# Altium project BrushedMotorBoard.PrjPcb
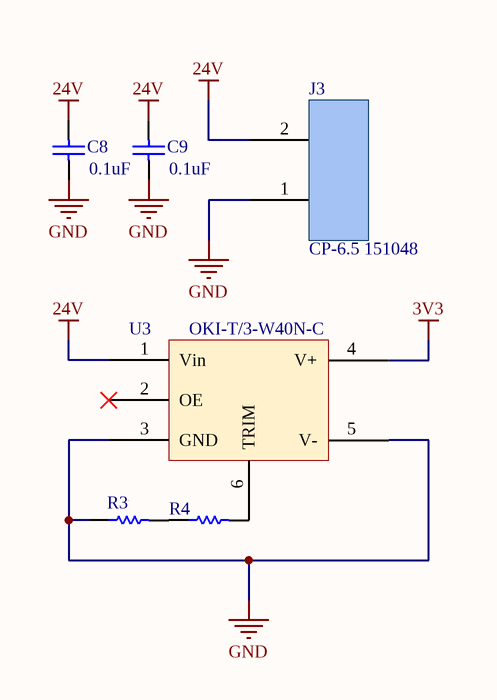
[diagram p0: Power.SchDoc]
3 sheets, 24 parts. Net scope: flat (ports and power ports of the same name join across sheets).
Sheets:
  Power.SchDoc
  Microcontroller.SchDoc
  Peripherals.SchDoc

## Sheet Power.SchDoc
size A

### Parts
C8  value 0.1uF  [CAPC3216X100X50LL20T25]  (hidden comment: C1206F104K3RACTU)
C9  value 0.1uF  [CAPC3216X100X50LL20T25]  (hidden comment: C1206F104K3RACTU)
J3  CP-6.5 151048
R3  RES SMD 6.2K OHM 5% 1/4W 1206  [RESC1206(3216)_L]  (value not drawn)
R4  RES SMD 6.2K OHM 5% 1/4W 1206  [RESC1206(3216)_L]  (value not drawn)
U3  OKI-T/3-W40N-C

### Nets
3V3: U3.4(V+)
24V: C8.1 C9.1 J3.2 U3.1(Vin)
GND: C8.2 C9.2 J3.1 R3.1 U3.3(GND) U3.5(V-)
NetR3_2: R3.2 R4.1
NetR4_2: R4.2 U3.6(TRIM)

Not connected (* = marked no-connect by the designer): U3 2(OE)*

### Library data of the parts
C8 C9 = CMP-1664-00001-1: CAP CER 0.1UF 25V 10% X7R 1206; PackageReference: 1206; PartNumber: C1206F104K3RACTU; ComponentLink1URL: http://www.kemet.com/docfinder?Partnumber=C1206F104K3RACTU; ComponentLink1Description: Datasheet
J3 = CP-6.5 151048: Connector Header Through Hole 2 position
R3 = CMP-1014-00659-1: Tolerance: 0.5%; Power: 0.25 W; Value: 6200; Case-EIA: 1206; Case-Metric: 3216; Technology: SMT
R4 = CMP-1014-00659-1: RES SMD 1.54K OHM 0.1% 1/4W 1206; Tolerance: 0.5%; Power: 0.25 W; Value: 6200; Case-EIA: 1206; Case-Metric: 3216; Technology: SMT

## Sheet Microcontroller.SchDoc
size A
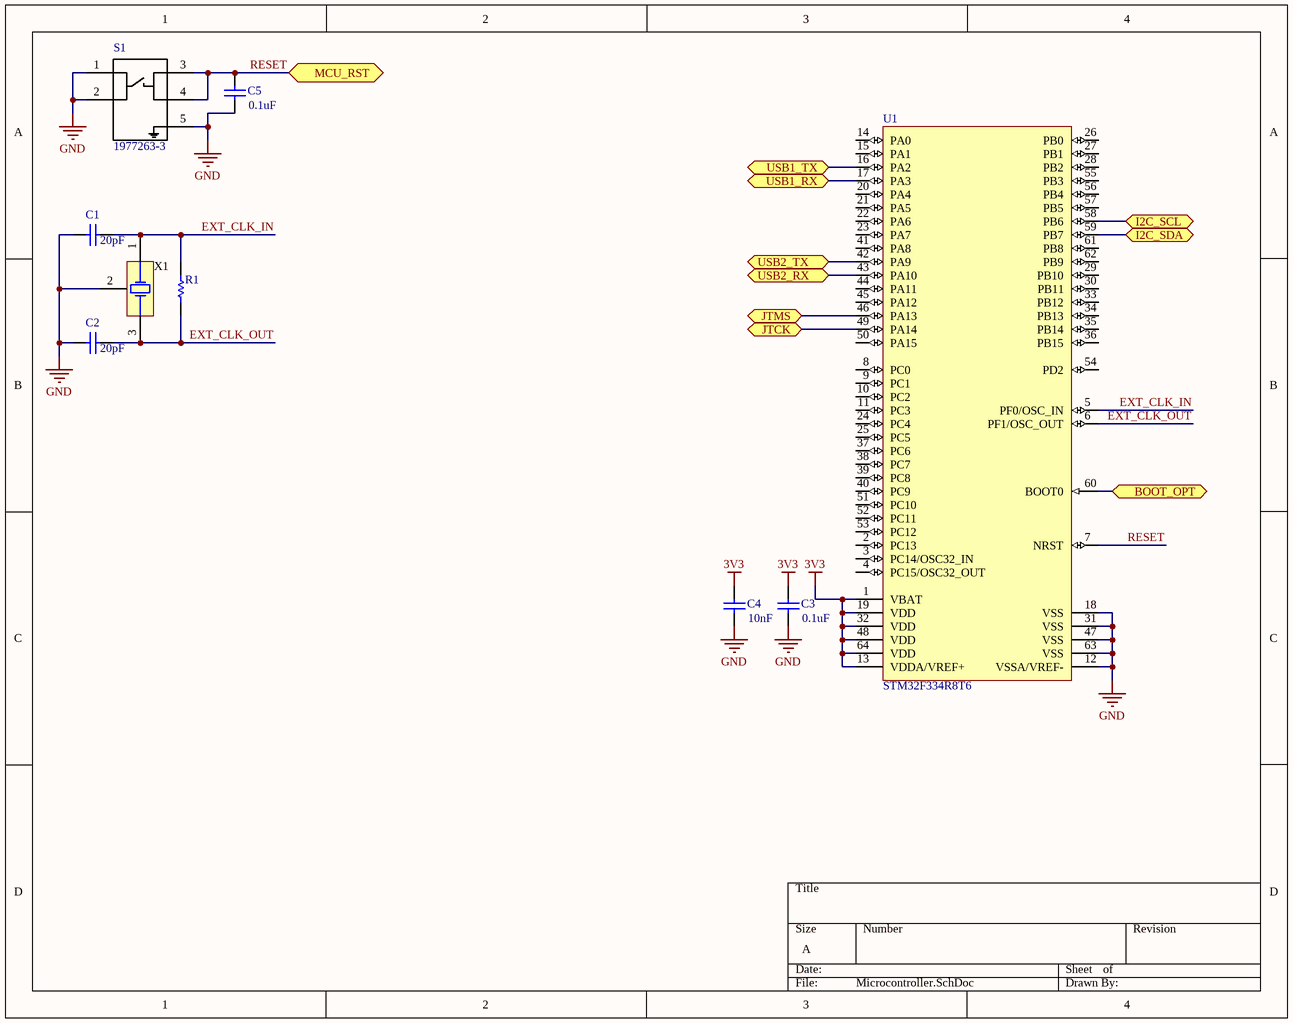
[diagram p1: Microcontroller.SchDoc]

### Parts
C1  value 20pF  [CAPC1206(3216)100_M]  (hidden comment: CAP 20pF 100V 1206(3216))
C2  value 20pF  [CAPC1206(3216)100_M]  (hidden comment: CAP 20pF 100V 1206(3216))
C3  value 0.1uF  [CAPC3216X100X50LL20T25]  (hidden comment: C1206F104K3RACTU)
C4  Capacitance: 10nF  [CAPC3216X88X50LL20T25]  (hidden comment: C1206C103K1RAC)
C5  value 0.1uF  [CAPC3216X100X50LL20T25]  (hidden comment: C1206F104K3RACTU)
R1  1M8 5% 1206(3216)  [RESC1206(3216)_M]  (value not drawn)
S1  1977263-3  [SW_1977263-3]
U1  STM32F334R8T6  [STM-LQFP64_L]
X1  ECS-200-20-4X-3IL  [ECS-4X-3IL]  (value not drawn)

### Ports
BOOT_OPT (bidir), I2C_SCL (bidir), I2C_SDA (bidir), JTCK (bidir), JTMS (bidir), MCU_RST (bidir), USB1_RX (bidir), USB1_TX (bidir), USB2_RX (bidir), USB2_TX (bidir)

### Nets
3V3: C3.1 C4.2 U1.1(VBAT) U1.13(VDDA/VREF+) U1.19(VDD) U1.32(VDD) U1.48(VDD) U1.64(VDD)
GND: C1.1 C2.1 C3.2 C4.1 C5.2 S1.1 S1.2 S1.5(GND) U1.12(VSSA/VREF-) U1.18(VSS) U1.31(VSS) U1.47(VSS) U1.63(VSS) X1.2
EXT_CLK_IN: C1.2 R1.2 U1.5(PF0/OSC_IN) X1.1
EXT_CLK_OUT: C2.2 R1.1 U1.6(PF1/OSC_OUT) X1.3
RESET: C5.1 S1.3 S1.4 U1.7(NRST) ; port MCU_RST
NetJ2_2: U1.43(PA10) ; port USB2_RX
NetJ2_3: U1.42(PA9) ; port USB2_TX
NetP1_2: U1.59(PB7) ; port I2C_SDA
NetP1_3: U1.58(PB6) ; port I2C_SCL
NetP1_4: U1.46(PA13) ; port JTMS
NetP1_5: U1.49(PA14) ; port JTCK
NetP3_2: U1.60(BOOT0) ; port BOOT_OPT
NetU1_16: U1.16(PA2) ; port USB1_TX
NetU1_17: U1.17(PA3) ; port USB1_RX

Not connected (* = marked no-connect by the designer): U1 2(PC13) 3(PC14/OSC32_IN) 4(PC15/OSC32_OUT) 8(PC0) 9(PC1) 10(PC2) 11(PC3) 14(PA0) 15(PA1) 20(PA4) 21(PA5) 22(PA6) 23(PA7) 24(PC4) 25(PC5) 26(PB0) 27(PB1) 28(PB2) 29(PB10) 30(PB11) 33(PB12) 34(PB13) 35(PB14) 36(PB15) 37(PC6) 38(PC7) 39(PC8) 40(PC9) 41(PA8) 44(PA11) 45(PA12) 50(PA15) 51(PC10) 52(PC11) 53(PC12) 54(PD2) 55(PB3) 56(PB4) 57(PB5) 61(PB8) 62(PB9)

### Library data of the parts
C1 C2 = CMP-1037-00946-1: CAP 20pF 100V ±10% 1206 (3216 Metric) Thickness 1mm SMD; Case-Metric: 3216; Case-EIA: 1206; Tolerance: Â±10%; Rated Voltage: 100 V; Max Thickness: 1 mm; Technology: SMT
C3 C5 = CMP-1664-00001-1: CAP CER 0.1UF 25V 10% X7R 1206; PackageReference: 1206; PartNumber: C1206F104K3RACTU; ComponentLink1URL: http://www.kemet.com/docfinder?Partnumber=C1206F104K3RACTU; ComponentLink1Description: Datasheet
C4 = CMP-2000-06007-1: Chip Capacitor, 0.01 uF, +/- 10%, 100 V, -55 to 125 degC, 1206 (3216 Metric), RoHS, Tape and Reel; Manufacturer: Kemet; Ceramic Capacitor Case: 1206[3216Metric]; No. of Pins: 2; SVHC: NoSVHC(16-Dec-2013); Product Range: KEMET-CSeries; Voltage Rating: 100V; Dielectric Characteristic: X7R; Capacitor Terminals: SMD; Operating Temperature Min: -55°C; Datasheet Version: 10/2016; Operating Temperature Range: -55°Cto+125°C; Operating Temperature Max: 125°C; Packaging: CutTape; RoHS Compliant: Yes; MSL: MSL1-Unlimited; Capacitance Tolerance: ±10%; Mounting Technology: SurfaceMount; Package Reference: 1206; Capacitor Case Style: 1206[3216Metric]; Datasheet URL: http://capacitoredge.kemet.com/capedge2/DataSheet/Datasheet-C1206C103K1RAC.pdf?pn=C1206C103K1RAC{BULK}; Package Description: 2-Pin Surface Mount Device, Body 3.2 x 1.6 mm; Manufacturer URL: http://www.kemet.com/
R1 = CMP-1014-00152-1: 1M8 0.25W 5% 1206 (3216 Metric)  SMD; Case-EIA: 1206; Value: 1800000.00 Ohm; Case-Metric: 3216; Tolerance: 5 %; Technology: SMT; Power: 0.25 W
S1 = 1977263-3: Switch Tactile OFF _ON_ SPST Round Button Gull Wing 0.05A 24VDC 1000000Cycle 2.55N SMD Bulk; MF: TE Connectivity / AMP; Price: 0.20 USD; Package: None; MP: 1977263-3; SnapEDA_Link: https://www.snapeda.com/parts/1977263-3/TE%20Connectivity%20/%20AMP/view-part/?ref=snap; Availability: Good; Value: *
U1 = CMP-0537-00077-1: ARM Cortex-M4 32-bit MCU, 64 KB Flash, 16 KB Internal RAM, 51 I/Os, 64-Pin LQFP, -40 to 85 degC, Tray; Supply Voltage(Vcc) min (V): 2; D/A Converter: 3; Internal RAM Size (kB): 16; FLASH Size (Prog) (kB): 64; Operating Frequency(F) (Processor speed) (MHz): 72; I/Os (High Current): 51; ComponentLink1Description: Manufacturer URL; ComponentLink2URL: http://www.st.com/st-web-ui/static/active/en/resource/technical/document/datasheet/DM00097745.pdf; Package Reference: LQFP64; ComponentLink1URL: http://www.st.com/; ComponentLink2Description: Datasheet; DatasheetVersion: Rev. 4; Mounting Technology: Surface Mount; Package Description: 64-Pin Low-profile Quad Flat Package, Body 10 x 10 mm, Pitch 0.5 mm; Packing: Tray; Core: ARM Cortex-M4
X1 = CMP-1669-00004-2: Quartz Crystal, 20 MHz, 20 pF, -10 to 70 degC, 2-Pin THD, RoHS, Bulk; Manufacturer: ECS; Height: 0.138 inch; Mounting Technology: Through Hole; Mount: Through Hole; Length: 0.447 inch; Packaging: Bulk; PackageDescription: 3-Pin Throung Hole Device, Body 11.35 x 4.65 mm; RoHSCompliant: True; Max Operating Temperature: 70 �C; ComponentLink1URL: https://www.ecsxtal.com/; DatasheetVersion: 02/2016; ComponentLink2URL: http://www.ecsxtal.com/store/pdf/hc-49usx.pdf; PackageReference: 4X-3IL; Min Operating Temperature: -10 �C; ComponentLink1Description: Manufacturer URL; Package Quantity: 200; ComponentLink2Description: Datasheet

## Sheet Peripherals.SchDoc
size A
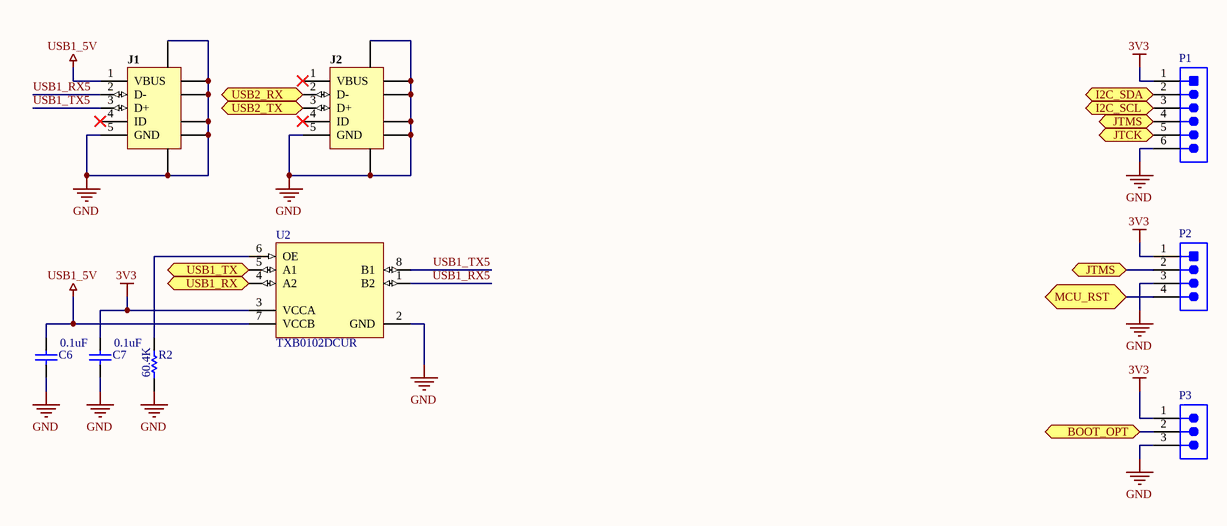
[diagram p2: Peripherals.SchDoc]

### Parts
C6  value 0.1uF  [CAPC3216X100X50LL20T25]  (hidden comment: C1206F104K3RACTU)
C7  value 0.1uF  [CAPC3216X100X50LL20T25]  (hidden comment: C1206F104K3RACTU)
J1  ZX62R-B-5P  [HIRO-ZX62R-B-5P_V]  (value not drawn)
J2  ZX62R-B-5P  [HIRO-ZX62R-B-5P_V]  (value not drawn)
P1  22-23-2061  [MOLX-22-23-2061_V]  (value not drawn)
P2  22-23-2041  [22-23-2041]  (value not drawn)
P3  PTT-103-01-L-S  [SMTC-PTT-103-01-X-S]  (value not drawn)
R2  value 60.4K  [RESC1206(3216)_M]  (hidden comment: 60K4 1% 1206(3216))
U2  TXB0102DCUR  [DCU0008A_N]

### Ports
BOOT_OPT (bidir), I2C_SCL (bidir), I2C_SDA (bidir), JTCK (bidir), JTMS (bidir), MCU_RST (bidir), USB1_RX (bidir), USB1_TX (bidir), USB2_RX (bidir), USB2_TX (bidir)

### Nets
3V3: C7.1 P1.1 P2.1 P3.1 U2.3(VCCA)
GND: C6.2 C7.2 J1.5(GND) J1.6(SHLD) J1.7(SHLD) J1.8(SHLD) J1.9(SHLD) J1.10(SHLD) J1.11(SHLD) J2.5(GND) J2.6(SHLD) J2.7(SHLD) J2.8(SHLD) J2.9(SHLD) J2.10(SHLD) J2.11(SHLD) P1.6 P2.3 P3.3 R2.1 U2.2(GND)
USB1_5V: C6.1 J1.1(VBUS) U2.7(VCCB)
RESET: P2.4 ; port MCU_RST
USB1_RX5: J1.2(D-) U2.1(B2)
USB1_TX5: J1.3(D+) U2.8(B1)
NetJ2_2: J2.2(D-) ; port USB2_RX
NetJ2_3: J2.3(D+) ; port USB2_TX
NetP1_2: P1.2 ; port I2C_SDA
NetP1_3: P1.3 ; port I2C_SCL
NetP1_4: P1.4 P2.2 ; port JTMS
NetP1_5: P1.5 ; port JTCK
NetP3_2: P3.2 ; port BOOT_OPT
NetR2_2: R2.2 U2.6(OE)
NetU1_16: U2.5(A1) ; port USB1_TX
NetU1_17: U2.4(A2) ; port USB1_RX

Not connected (* = marked no-connect by the designer): J1 4(ID)*; J2 1(VBUS)* 4(ID)*

### Library data of the parts
C6 C7 = CMP-1664-00001-1: CAP CER 0.1UF 25V 10% X7R 1206; PackageReference: 1206; PartNumber: C1206F104K3RACTU; ComponentLink1URL: http://www.kemet.com/docfinder?Partnumber=C1206F104K3RACTU; ComponentLink1Description: Datasheet
J1 J2 = CMP-0031-00001-1: Connector; USBMicro-B,Reverse type, SMT; 5 Position; Right Angle; DatasheetVersion: 08/2010; Operating Temperature: -30 to 85 degC; Mounting Technology: Surface Mount; PartNumber: ZX62R-B-5P; PackageReference: ZX62R-B-5P; ComponentLink2URL: http://www.hirose.co.jp/cataloge_hp/e24200011.pdf; ComponentLink1URL: http://www.hirose.com/â€Ž; ComponentLink2Description: Datasheet; PackageDescription: 5-Pin USB Micro-B R/A Connector; ComponentLink1Description: Manufacturer URL
P1 = CMP-2000-05536-1: Male Header, Pitch 2.54 mm, 1 x 6 Position, Height 10.67 mm, Tail Length 3.56 mm, 0 to 70 degC, RoHS, Bulk; Manufacturer: Molex; Pitch: 2.54mm; Mounting Angle: Vertical; Current Rating: 4A; Number of Positions / Contacts: 6; Voltage Rating: 250V; Packaging: Bulk; Package Description: Male Header, Pitch 2.54 mm, 1 x 6 Position, Height 10.67 mm, Tail Length 3.56 mm; Number of Rows: 1; Type: PinStrip; Contact Material: Brass; Product Category: .100K.K.Connectors; Factory Pack Quantity: 1000; Mounting Style: ThroughHole; RoHS: Details; Contact Plating: Tin; Housing Material: Nylon; Mounting Technology: ThroughHole; Termination Style: ThroughHole; Tradename: KK; Number of Positions: 6; Brand: Molex; Product Type: Headers; Series: 6373; Datasheet URL: https://datasheet.ciiva.com/19460/232303-19460895.pdf; Package Reference: 22-23-2061; Datasheet Version: Rev. P, 09/2001; Manufacturer URL: http://www.molex.com/
P2 = 22-23-2041: MOLEX 4POS MALE HEADER VERT
P3 = CMP-1029-00143-1: Press Fit Header, Through-hole, Vertical, -55 to 125 degC, 2 mm Pitch, 3-Pin, Male, RoHS; Manufacturer: Samtec; Pitch: 2 mm; ComponentLink1Description: Manufacturer URL; ComponentLink3URL: http://www.samtec.com/documents/webfiles/cpdf/PTT-1XX-01-X-S-XXX-MKT.pdf; ComponentLink2Description: Datasheet; ComponentLink1URL: http://www.samtec.com; Temperature Range: -55 to 125 degC; PackageReference: PTT-103-01-X-S; PartNumber: PTT-103-01-L-S; PackageDescription: 2 mm Press Fit Terminal Strip; ComponentLink2URL: http://d2a072wq521u33.cloudfront.net/catalog_english//ptt.pdf; DatasheetVersion: F-214; Mounting Technology: Through-hole; RoHS: True; PackageVersion: C, 1/2011; ComponentLink3Description: Package Specification; Orientation: Vertical
R2 = CMP-1014-00711-1: 60K4 0.25W 1% 1206 (3216 Metric)  SMD; Case-EIA: 1206; Case-Metric: 3216; Technology: SMT; Tolerance: 1 %; Power: 0.25 W
U2 = CMP-0859-00594-3: 2-Bit Bidirectional Voltage-Level Translator with Auto Direction Sensing and +/-15-kV ESD Protect, DCU0008A, LARGE T&R; Manufacturer: Texas Instruments; Rating: Catalog; tpd @ Nom Voltage(Max)(ns): 4.9; Output Type: CMOS; Sub-Family: Dual Supply Translator; Bits(#): 2; Logic: True; Input Type: CMOS/TTL; 3-State Output: No; Voltage(Nom)(V): 3.3; VCC(Min)(V): 1.2; ICC @ Nom Voltage(Max)(mA): 0.005; VCC(Max)(V): 5.5; PackageReference: DCU0008A; Operating Temperature Range(C): -40 to 85; DatasheetVersion: SCES641C; Schmitt Trigger: No; Generic Part Number: TXB0102

## Nets that join several sheets
3V3: Power (U3.4), Microcontroller (8 pins), Peripherals (5 pins)
GND: Power (6 pins), Microcontroller (14 pins), Peripherals (21 pins)
NetJ2_2: Microcontroller (U1.43), Peripherals (J2.2)
NetJ2_3: Microcontroller (U1.42), Peripherals (J2.3)
NetP1_2: Microcontroller (U1.59), Peripherals (P1.2)
NetP1_3: Microcontroller (U1.58), Peripherals (P1.3)
NetP1_4: Microcontroller (U1.46), Peripherals (P1.4 P2.2)
NetP1_5: Microcontroller (U1.49), Peripherals (P1.5)
NetP3_2: Microcontroller (U1.60), Peripherals (P3.2)
NetU1_16: Microcontroller (U1.16), Peripherals (U2.5)
NetU1_17: Microcontroller (U1.17), Peripherals (U2.4)
RESET: Microcontroller (C5.1 S1.3 S1.4 U1.7), Peripherals (P2.4)